# EAGLE design VisualEar-3.0 (EAGLE 9.6.2)
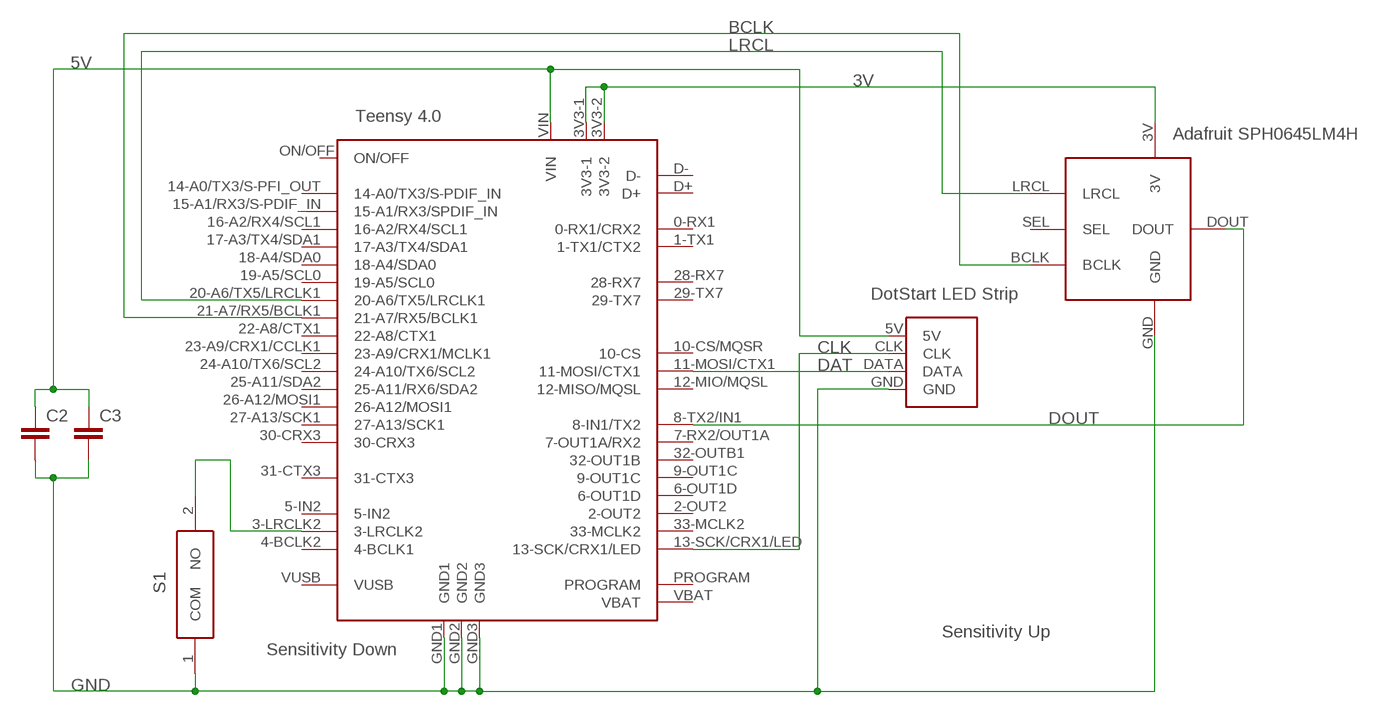
[diagram p0: schematic, sheet 1]

## Parts
C2  CAPPTH3  [CAP-PTH-LARGE]
C3  CAPPTH3  [CAP-PTH-LARGE]
S1  TACTILE-SWITCHTHRU-HOLE  [CLICK-WEL]
U$1  TEENSY40DIPPLUS5  [TEENSY40-DIP+5]
U$3  AF-I2S-MIC  [AF-I2S-MIC]
U$4  LED-STRIP  [LED_STRIP]

## Nets
3V: U$1.3V3-1 U$1.3V3-2 U$3.3V
5V: C2.1 C3.1 U$1.VIN U$4.5V
BCLK: U$1.21-A7/RX5/BCLK1 U$3.BCLK
CLK: U$1.13-SCK/CRX1/LED U$4.CLK
DAT: U$1.11-MOSI/CTX1 U$4.DATA
DOUT: U$1.8-TX2/IN1(8-IN1/TX2) U$3.DOUT
GND: C2.2 C3.2 S1.1(COM) U$1.GND1 U$1.GND2 U$1.GND3 U$3.GND U$4.GND
LRCL: U$1.20-A6/TX5/LRCLK1 U$3.LRCL
N$2: S1.2(NO) U$1.3-LRCLK2
Unconnected: U$1.0-RX1(0-RX1/CRX2) U$1.1-TX1(1-TX1/CTX2) U$1.2-OUT2 U$1.4-BCLK2(4-BCLK1) U$1.5-IN2 U$1.6-OUT1D U$1.7-RX2/OUT1A(7-OUT1A/RX2) U$1.9-OUT1C U$1.10-CS/MQSR(10-CS) U$1.12-MIO/MQSL(12-MISO/MQSL) U$1.14-A0/TX3/S-PFI_OUT(14-A0/TX3/S-PDIF_IN) U$1.15-A1/RX3/S-PDIF_IN(15-A1/RX3/SPDIF_IN) U$1.16-A2/RX4/SCL1 U$1.17-A3/TX4/SDA1 U$1.18-A4/SDA0 U$1.19-A5/SCL0 U$1.22-A8/CTX1 U$1.23-A9/CRX1/CCLK1(23-A9/CRX1/MCLK1) U$1.24-A10/TX6/SCL2 U$1.25-A11/SDA2(25-A11/RX6/SDA2) U$1.26-A12/MOSI1 U$1.27-A13/SCK1 U$1.28-RX7 U$1.29-TX7 U$1.30-CRX3 U$1.31-CTX3 U$1.32-OUTB1(32-OUT1B) U$1.33-MCLK2 U$1.D+ U$1.D- U$1.ON/OFF U$1.PROGRAM U$1.VBAT U$1.VUSB U$3.SEL

## Notes on the sheet
- Teensy 4.0
- Adafruit SPH0645LM4H
- DotStart LED Strip
- Sensitivity Up
- Sensitivity Down

## Library data of the parts
C2 C3 = philbot:CAP: Capacitor Standard 0603 ceramic capacitor, and 0.1" leaded capacitor.
S1 = philbot:TACTILE-SWITCH: Tactile Switches Tact 50mA 12VDC, 6.0x3.5, 2.5mm H, 250gf, J leads, No ground pin, Red Actuator Source: Datasheet <https://www.mouser.com/datasheet/2/60/pts636-1550567.pdf>
U$1 = teensy:TEENSY40: Teensy 4.0 device including POGO pins for pins 24 - 33, but not yet pins for D+ and D-. Symbol layout is what works for me and may not suite everyone... that can be added or additional symbols can be created to be used in a modilied davie name.
U$3 = philbot:AF-I2S-MIC
U$4 = philbot:LED-STRIP

## Board
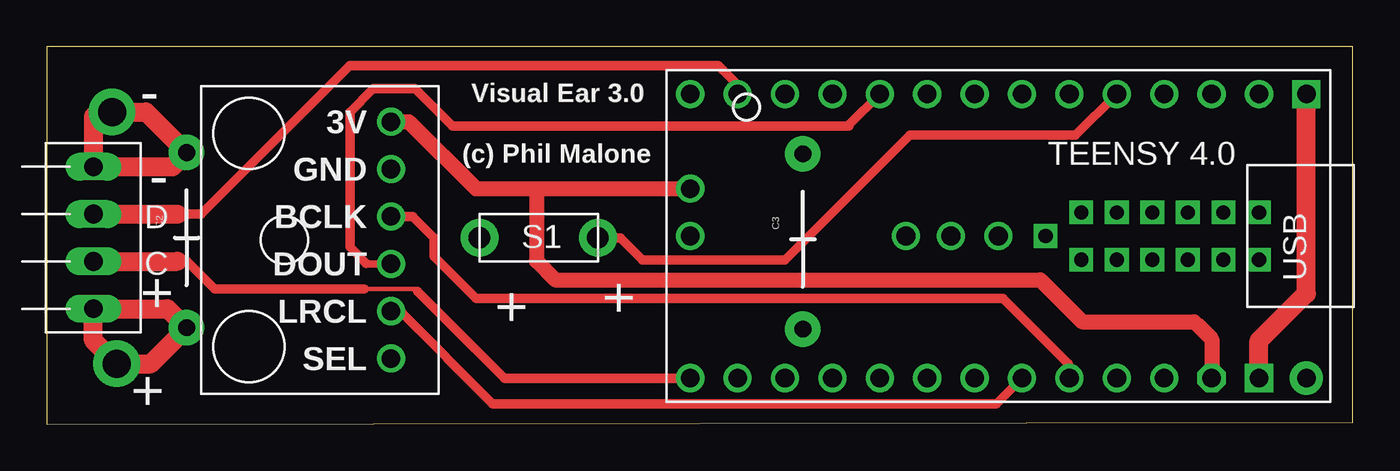
[diagram p1: board, top side]
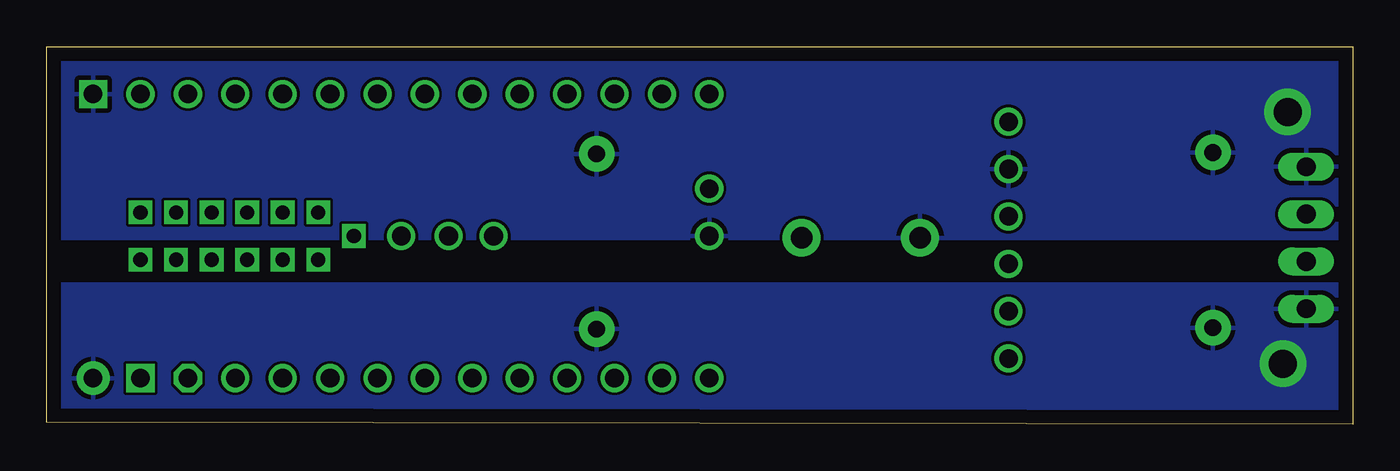
[diagram p2: board, bottom side, seen from below]

Size 70 x 20.25 mm. Coordinates in mm from the lower left corner, seen from the top.
Outline: 0,0 70,0.12 70,20.25 0,20.25 0,0
Copper layers (1*16): Top 0.035mm / dielectric 1.5mm / Bottom 0.035mm
Design rules "default *": minimum track width 6mil, minimum drill 0.35mm, track to track 6mil, track to pad 6mil, pad to pad 6mil, via to via 6mil, smd to smd 6mil, copper to edge 30mil, drill to drill 6mil, minimum pad ring 10mil, minimum via ring 8mil, stop-mask expansion 4mil, vias tented up to drill 0mil, thermal gap 10mil

### Footprints (pad centres in the part's own frame; a part is rotated, then mirrored left to right if it is on the bottom)
CAP-PTH-LARGE = drill 0.9 pad 1.905: 1 -4.826,0; 2 4.572,0
CLICK-WEL = drill 1.143 pad 2.032: 1 -3.81,0; 2 2.54,0
TEENSY40-DIP+5 = drill 1: 0-RX1 -13.97,-7.62; 1-TX1 -11.43,-7.62; 2-OUT2 -8.89,-7.62; 3-LRCLK2 -6.35,-7.62; 3V3-2 16.51,-2.54; 4-BCLK2 -3.81,-7.62; 5-IN2 -1.27,-7.62; 6-OUT1D 1.27,-7.62; 7-RX2/OUT1A 3.81,-7.62; 8-TX2/IN1 6.35,-7.62; 9-OUT1C 8.89,-7.62; 10-CS/MQSR 11.43,-7.62; 11-MOSI/CTX1 13.97,-7.62; 12-MIO/MQSL 16.51,-7.62; 13-SCK/CRX1/LED 16.51,7.62; 14-A0/TX3/S-PFI_OUT 13.97,7.62; 15-A1/RX3/S-PDIF_IN 11.43,7.62; 16-A2/RX4/SCL1 8.89,7.62; 17-A3/TX4/SDA1 6.35,7.62; 18-A4/SDA0 3.81,7.62; 19-A5/SCL0 1.27,7.62; 20-A6/TX5/LRCLK1 -1.27,7.62; 21-A7/RX5/BCLK1 -3.81,7.62; 22-A8/CTX1 -6.35,7.62; 23-A9/CRX1/CCLK1 -8.89,7.62; GND2 16.51,0; ON/OFF 4.953,0; PROGRAM 0,0; VBAT 2.54,0 | drill 1 octagon: 3V3-1 -11.43,7.62 | drill 0.762 pad 1.143 square: 24-A10/TX6/SCL2 -6.35,1.27; 25-A11/SDA2 -10.16,-1.27; 26-A12/MOSI1 -4.445,1.27; 27-A13/SCK1 -8.255,-1.27; 28-RX7 -10.16,1.27; 29-TX7 -6.35,-1.27; 30-CRX3 -12.065,1.27; 31-CTX3 -4.445,-1.27; 32-OUTB1 -13.97,1.27; 33-MCLK2 -2.54,0; D+ -13.97,-1.27; D- -8.255,1.27; VUSB -12.065,-1.27 | drill 1 square: GND1 -16.51,-7.62; GND3 -13.97,7.62 | drill 1 pad 1.778: VIN -16.51,7.62
AF-I2S-MIC = drill 1: 3V 6.35,-3.81; BCLK 1.27,-3.81; DOUT -1.27,-3.81; GND 3.81,-3.81; LRCL -3.81,-3.81; SEL -6.35,-3.81
LED_STRIP = drill 1 long: 5V 0,3.81; CLK 0,1.27; DATA 0,-1.27; GND 0,-3.81

### Placement (x,y rotation side)
C2  7.5,10 90 top
C3  40.53,9.93 90 top
S1  27,10 0 top
U$1  51,10.09 180 top
U$3  14.64,9.87 90 top
U$4  2.5,10 180 top

### Tracks (layer width: path | path; a pad name or v marks a point on that pad's centre or on a via)
3V
  Top 0.254: U$1.3V3-2 26.25,12.63 23,12.63 | 61.5,5.5 61.62,5.38
  Top 0.813: U$3.3V 19.41,16.22 23,12.63 U$1.3V3-2 | 26.25,12.63 26.25,8.75 27.25,7.75 53.25,7.75 55.5,5.5 61.5,5.5 | 61.62,5.38 62.43,4.57 U$1.3V3-1
5V  (via drill 1.5 pad 2.5)
  Top 1.016: U$4.5V 6.48,6.19 C2.1 5.58,3.25 v3.75,3.25 2.5,4.5 U$4.5V
  pour Bottom: 0,0 0,7.5 70,7.5 70,0
BCLK
  Top 0.254: U$1.21-A7/RX5/BCLK1 54.75,2.53 54.75,3.25 | 19.61,11.14 19.62,11.12
  Top 0.508: U$3.BCLK 19.61,11.14 | 19.62,11.12 20.75,10 20.75,9 23,6.75 51.25,6.75 54.75,3.25
CLK
  Top 0.254: 19.88,7.12 19.75,7.25 17,7.25
  Top 0.508: 7,8.73 7.52,8.73 9,7.25 17,7.25 | U$1.13-SCK/CRX1/LED 24.53,2.47 19.88,7.12
  Top 1.016: U$4.CLK 7,8.73
DAT
  Top 0.254: 37.03,17.75 37.03,18 | 36.12,19.12 36.24,19 | 36.01,19.23 35.99,19.25
  Top 0.508: 7,11.27 8.27,11.27 16.23,19.23 36.01,19.23 36.12,19.12 | 36.24,19 37.03,18.21 37.03,18 | U$1.11-MOSI/CTX1 37.03,17.75
  Top 1.016: U$4.DATA 7,11.27
DOUT
  Top 0.254: U$1.8-TX2/IN1 44.65,17.65 43,16 | 17.15,8.6 17.12,8.62
  Top 0.406: U$3.DOUT 17.15,8.6
  Top 0.508: 17.12,8.62 16.25,9.5 16.25,16.75 17.5,18 19.75,18 21.75,16 43,16 43,16.06 U$1.8-TX2/IN1
GND  (via drill 1.5 pad 2.5)
  Top 1.016: U$1.GND3 64.97,4.47 67.51,7.01 U$1.GND1 | U$4.GND 6.74,13.81 C2.2 5.32,16.75 v3.5,16.75 3.25,16.5 2.5,16.5 U$4.GND
  pour Bottom: 0,20.25 70,20.25 70,10 0,10
LRCL
  Top 0.508: U$3.LRCL 18.94,6.06 23.91,1.09 47.23,1.09 50.9,1.1 U$1.20-A6/TX5/LRCLK1
N$2
  Top 0.508: U$1.3-LRCLK2 55.14,15.5 46.25,15.5 39.56,8.81 31.94,8.81 30.75,10 S1.2

### Text on the board
tPlace: - | Visual Ear 3.0 | (c) Phil Malone | - | D | C | + | + | + | +